# EAGLE design miniprinter-sanguinololu-longboard (EAGLE 9.4.2)
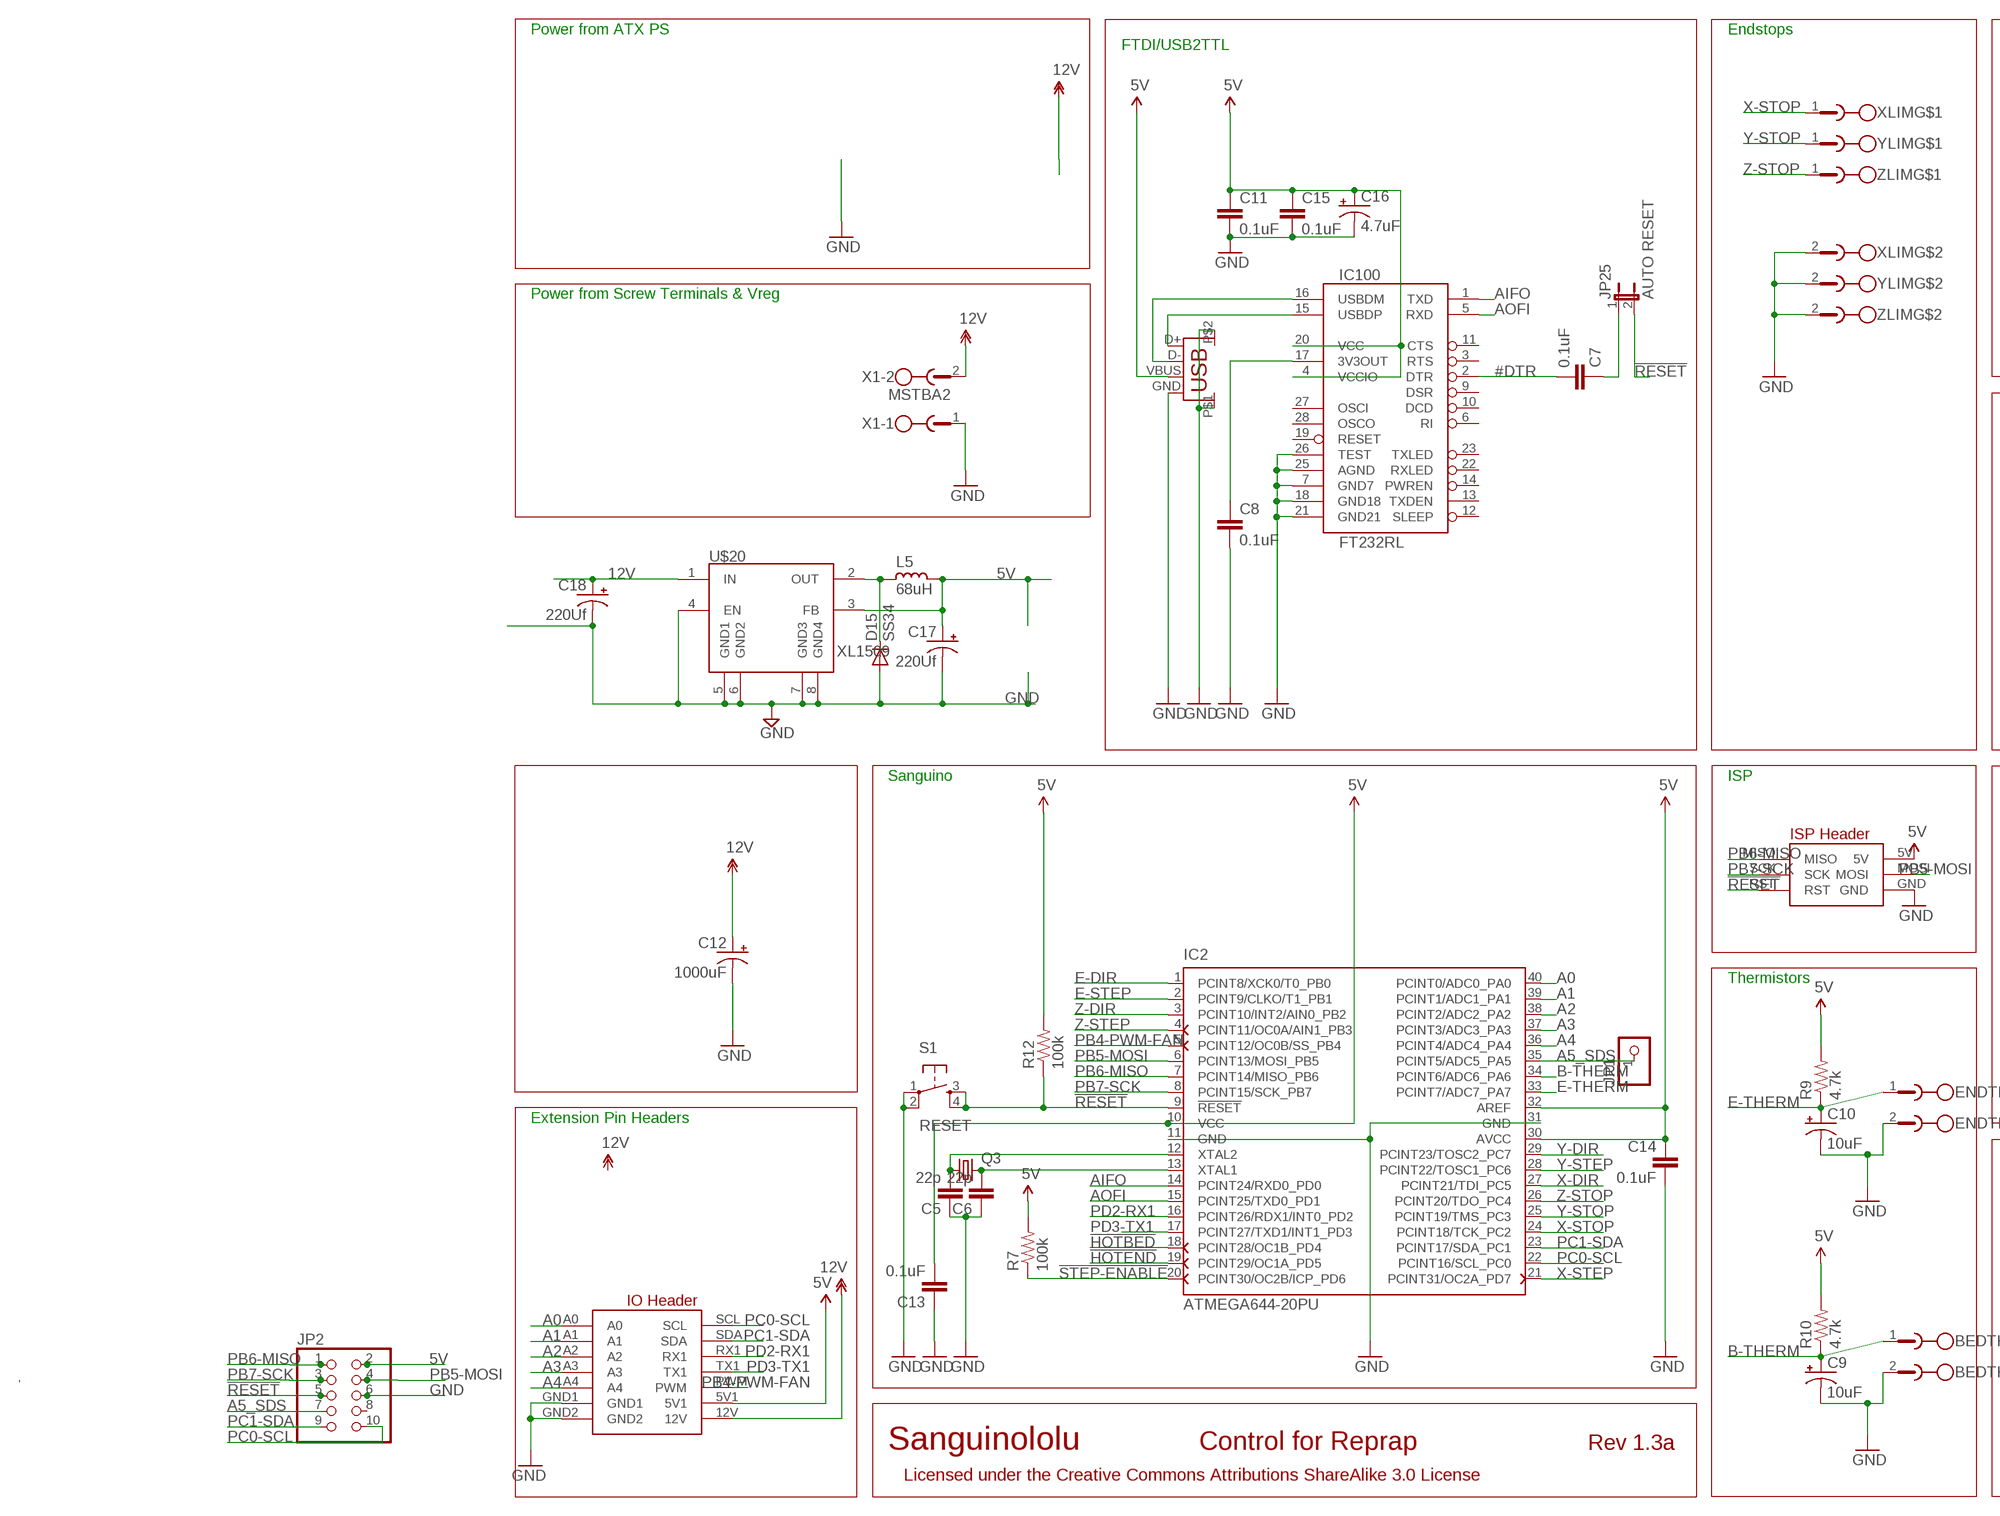
[diagram p0: schematic, sheet 1, part 1 of 2]
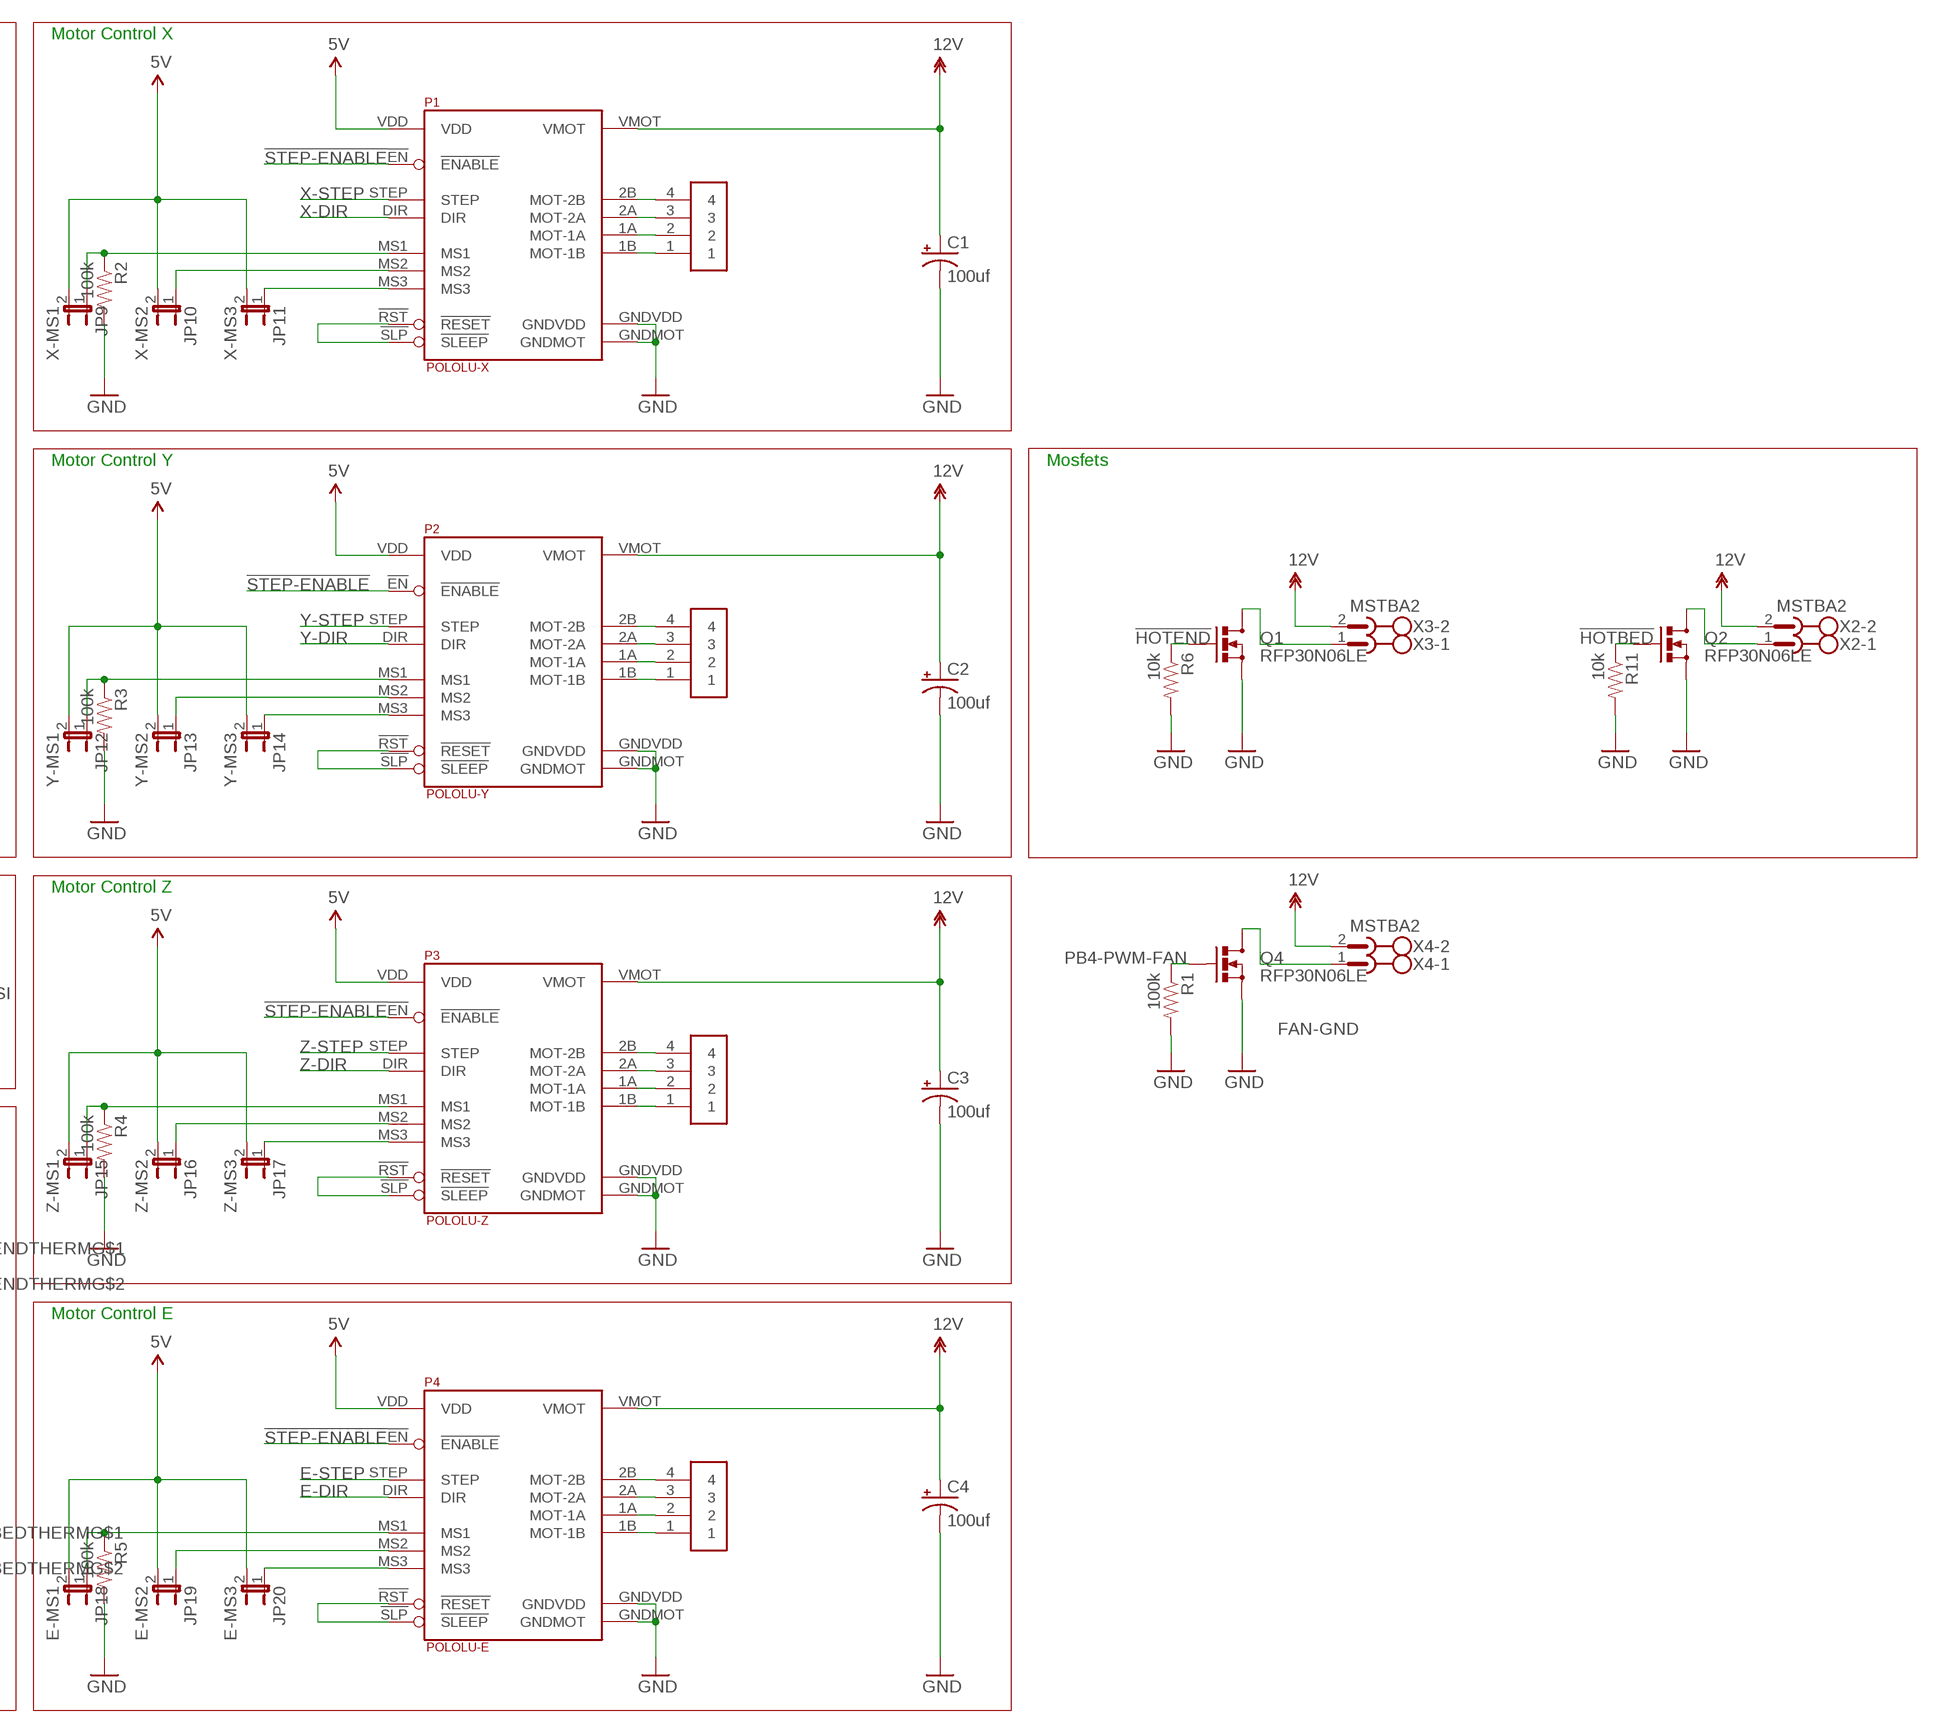
[diagram p1: schematic, sheet 1, part 2 of 2]

## Parts
BEDTHERM  Phoenix Pluggable 3.81mm 2 way  MC1.5/2  [MC1.5/2-G-3.81]
C1  100uf  CAP_POLPTH1  [CPOL-RADIAL-100UF-25V]
C2  100uf  CAP_POLPTH1  [CPOL-RADIAL-100UF-25V]
C3  100uf  CAP_POLPTH1  [CPOL-RADIAL-100UF-25V]
C4  100uf  CAP_POLPTH1  [CPOL-RADIAL-100UF-25V]
C5  22p  CAPPTH2  [CAP-PTH-SMALL2]
C6  22p  CAPPTH2  [CAP-PTH-SMALL2]
C7  0.1uF  CAPPTH2  [CAP-PTH-SMALL2]
C8  0.1uF  CAPPTH2  [CAP-PTH-SMALL2]
C9  10uF  CAP_POLPTH2  [CPOL-RADIAL-10UF-25V]
C10  10uF  CAP_POLPTH2  [CPOL-RADIAL-10UF-25V]
C11  0.1uF  CAPPTH2  [CAP-PTH-SMALL2]
C12  1000uF  CAP_POLPTH4  [CPOL-RADIAL-1000UF-25V]
C13  0.1uF  CAPPTH2  [CAP-PTH-SMALL2]
C14  0.1uF  CAPPTH2  [CAP-PTH-SMALL2]
C15  0.1uF  CAPPTH2  [CAP-PTH-SMALL2]
C16  4.7uF  CAP_POLPTH2  [CPOL-RADIAL-10UF-25V]
C17  220Uf  CAP_POLPTH1  [CPOL-RADIAL-100UF-25V]
C18  220Uf  CAP_POLPTH1  [CPOL-RADIAL-100UF-25V]
D15  SS34  DIODE-DO-214AC  [DO-214AC]
ENDTHERM  Phoenix Pluggable 3.81mm 2 way  MC1.5/2  [MC1.5/2-G-3.81]
IC2  ATMEGA644-20PU  [DIL40]
IC100  FT232RL  FT232RLSSOP  [SSOP28DB]
J1  USB  USBPTH  [USB-B-PTH]
JP1  PINHD-1X1  [1X01]
JP2  PINHD-2X5  [2X05]
JP9  X-MS1  JUMPER-2PTH  [1X02]
JP10  X-MS2  JUMPER-2PTH  [1X02]
JP11  X-MS3  JUMPER-2PTH  [1X02]
JP12  Y-MS1  JUMPER-2PTH  [1X02]
JP13  Y-MS2  JUMPER-2PTH  [1X02]
JP14  Y-MS3  JUMPER-2PTH  [1X02]
JP15  Z-MS1  JUMPER-2PTH  [1X02]
JP16  Z-MS2  JUMPER-2PTH  [1X02]
JP17  Z-MS3  JUMPER-2PTH  [1X02]
JP18  E-MS1  JUMPER-2PTH  [1X02]
JP19  E-MS2  JUMPER-2PTH  [1X02]
JP20  E-MS3  JUMPER-2PTH  [1X02]
JP25  AUTO RESET  JUMPER-2PTH  [1X02]
L5  68uH  L_CD75  [CD75]
P1  POLOLU-X  POLOLU-ALLEGRO  [POLOLU-ALLEGRO-PTH]
P2  POLOLU-Y  POLOLU-ALLEGRO  [POLOLU-ALLEGRO-PTH]
P3  POLOLU-Z  POLOLU-ALLEGRO  [POLOLU-ALLEGRO-PTH]
P4  POLOLU-E  POLOLU-ALLEGRO  [POLOLU-ALLEGRO-PTH]
Q1  RFP30N06LE  MOSFET-NCHANNELPTH2  [TO220V]
Q2  RFP30N06LE  MOSFET-NCHANNELPTH2  [TO220V]
Q3  CRYSTALHC49S  [HC49/S]
Q4  RFP30N06LE  MOSFET-NCHANNELPTH2  [TO220V]
R1  100k  RESISTORPTH1  [AXIAL-0.3]
R2  100k  RESISTORPTH1  [AXIAL-0.3]
R3  100k  RESISTORPTH1  [AXIAL-0.3]
R4  100k  RESISTORPTH1  [AXIAL-0.3]
R5  100k  RESISTORPTH1  [AXIAL-0.3]
R6  10k  RESISTORPTH1  [AXIAL-0.3]
R7  100k  RESISTORPTH1  [AXIAL-0.3]
R9  4.7k  RESISTORPTH1  [AXIAL-0.3]
R10  4.7k  RESISTORPTH1  [AXIAL-0.3]
R11  10k  RESISTORPTH1  [AXIAL-0.3]
R12  100k  RESISTORPTH1  [AXIAL-0.3]
S1  RESET  TAC_SWITCHPTH  [TACTILE-PTH]
U$17  CONNECTOR-M4  [3.81MM-4WAY-PLUGGABLE-SCREW]
U$20  XL1509  [SO08]
U$24  IO_HEADERS_SCREW  [IO_HEADER-PLATEDSCREW]
U$25  CONNECTOR-M4  [3.81MM-4WAY-PLUGGABLE-SCREW]
U$26  CONNECTOR-M4  [3.81MM-4WAY-PLUGGABLE-SCREW]
U$27  CONNECTOR-M4  [3.81MM-4WAY-PLUGGABLE-SCREW]
X1  MSTBA2  [MSTBA2]
X2  MSTBA2  [MSTBA2]
X3  MSTBA2  [MSTBA2]
X4  MSTBA2  [MSTBA2]
XLIM  Phoenix Pluggable 3.81mm 2 way  MC1.5/2  [MC1.5/2-G-3.81]
YLIM  Phoenix Pluggable 3.81mm 2 way  MC1.5/2  [MC1.5/2-G-3.81]
ZLIM  Phoenix Pluggable 3.81mm 2 way  MC1.5/2  [MC1.5/2-G-3.81]

## Nets
3V3: C8.1 IC100.17(3V3OUT)
5V: C11.1 C13.2 C14.1 C15.1 C16.1(+) C17.1(+) IC2.10(VCC) IC2.30(AVCC) IC2.32(AREF) IC100.4(VCCIO) IC100.20(VCC) J1.VBUS JP2.2 JP9.2 JP10.2 JP11.2 JP12.2 JP13.2 JP14.2 JP15.2 JP16.2 JP17.2 JP18.2 JP19.2 JP20.2 L5.1 P1.VDD P2.VDD P3.VDD P4.VDD R7.P$2 R9.P$2 R10.P$2 R12.P$2 U$20.3(FB) U$24.5V U$24.5V1
12V: C1.1(+) C2.1(+) C3.1(+) C4.1(+) C12.1(+) C18.1(+) P1.VMOT P2.VMOT P3.VMOT P4.VMOT U$20.1(IN) U$24.12V X1.2 X2.2 X3.2 X4.2
!FTDI-RESET: C7.1 JP25.1
!HOTBED: IC2.18(PCINT28/OC1B_PD4) Q2.1(G) R11.P$1
!HOTEND: IC2.19(PCINT29/OC1A_PD5) Q1.1(G) R6.P$1
!RESET: IC2.9(!RESET) JP2.5 JP25.2 R12.P$1 S1.3 S1.4 U$24.RST
!STEP-ENABLE: IC2.20(PCINT30/OC2B/ICP_PD6) P1.!EN(!ENABLE) P2.!EN(!ENABLE) P3.!EN(!ENABLE) P4.!EN(!ENABLE) R7.P$1
#DTR: C7.2 IC100.2(DTR)
A0: IC2.40(PCINT0/ADC0_PA0) U$24.A0
A1: IC2.39(PCINT1/ADC1_PA1) U$24.A1
A2: IC2.38(PCINT2/ADC2_PA2) U$24.A2
A3: IC2.37(PCINT3/ADC3_PA3) U$24.A3
A4: IC2.36(PCINT4/ADC4_PA4) U$24.A4
A5_SDS: IC2.35(PCINT5/ADC5_PA5) JP1.1 JP2.7
AIFO: IC2.14(PCINT24/RXD0_PD0) IC100.1(TXD)
AOFI: IC2.15(PCINT25/TXD0_PD1) IC100.5(RXD)
B-THERM: BEDTHERM.1 C9.1(+) IC2.34(PCINT6/ADC6_PA6) R10.P$1
E-DIR: IC2.1(PCINT8/XCK0/T0_PB0) P4.DIR
E-MS1: JP18.1 P4.MS1 R5.P$1
E-MS2: JP19.1 P4.MS2
E-MS3: JP20.1 P4.MS3
E-RESETSLEEP: P4.!RST(!RESET) P4.!SLP(!SLEEP)
E-STEP: IC2.2(PCINT9/CLKO/T1_PB1) P4.STEP
E-THERM: C10.1(+) ENDTHERM.1 IC2.33(PCINT7/ADC7_PA7) R9.P$1
FAN-GND [power]: Q4.2(D) X4.1
GND [power]: BEDTHERM.2 C1.2(-) C2.2(-) C3.2(-) C4.2(-) C5.1 C6.1 C8.2 C9.2(-) C10.2(-) C11.2 C12.2(-) C13.1 C14.2 C15.2 C16.2(-) C17.2(-) C18.2(-) D15.2(A) ENDTHERM.2 IC2.11(GND) IC2.31(GND) IC100.7(GND7) IC100.18(GND18) IC100.21(GND21) IC100.25(AGND) IC100.26(TEST) J1.GND J1.P$1 J1.P$2 JP2.6 P1.GNDMOT P1.GNDVDD P2.GNDMOT P2.GNDVDD P3.GNDMOT P3.GNDVDD P4.GNDMOT P4.GNDVDD Q1.3(S) Q2.3(S) Q4.3(S) R1.P$2 R2.P$2 R3.P$2 R4.P$2 R5.P$2 R6.P$2 R11.P$2 S1.1 S1.2 U$20.4(EN) U$20.5(GND1) U$20.6(GND2) U$20.7(GND3) U$20.8(GND4) U$24.GND U$24.GND1 U$24.GND2 X1.1 XLIM.2 YLIM.2 ZLIM.2
HOTBED-GND [power]: Q2.2(D) X2.1
HOTEND-GND [power]: Q1.2(D) X3.1
N$1: P4.1B(MOT-1B) U$27.1
N$3: P4.1A(MOT-1A) U$27.2
N$4: P4.2A(MOT-2A) U$27.3
N$5: P4.2B(MOT-2B) U$27.4
N$6: P3.1B(MOT-1B) U$26.1
N$7: P3.1A(MOT-1A) U$26.2
N$8: P3.2A(MOT-2A) U$26.3
N$9: P3.2B(MOT-2B) U$26.4
N$10: P2.1B(MOT-1B) U$25.1
N$11: P2.1A(MOT-1A) U$25.2
N$12: P2.2A(MOT-2A) U$25.3
N$13: P2.2B(MOT-2B) U$25.4
N$14: P1.1B(MOT-1B) U$17.1
N$15: P1.1A(MOT-1A) U$17.2
N$16: P1.2A(MOT-2A) U$17.3
N$17: P1.2B(MOT-2B) U$17.4
N$23: D15.1(C) L5.2 U$20.2(OUT)
PB4-PWM-FAN: IC2.5(PCINT12/OC0B/SS_PB4) Q4.1(G) R1.P$1 U$24.PWM
PB5-MOSI: IC2.6(PCINT13/MOSI_PB5) JP2.4 U$24.MOSI
PB6-MISO: IC2.7(PCINT14/MISO_PB6) JP2.1 U$24.MISO
PB7-SCK: IC2.8(PCINT15/SCK_PB7) JP2.3 U$24.SCK
PC0-SCL: IC2.22(PCINT16/SCL_PC0) JP2.10 U$24.SCL
PC1-SDA: IC2.23(PCINT17/SDA_PC1) JP2.9 U$24.SDA
PD2-RX1: IC2.16(PCINT26/RDX1/INT0_PD2) U$24.RX1
PD3-TX1: IC2.17(PCINT27/TXD1/INT1_PD3) U$24.TX1
USBDM: IC100.16(USBDM) J1.D-
USBDP: IC100.15(USBDP) J1.D+
X-DIR: IC2.27(PCINT21/TDI_PC5) P1.DIR
X-MS1: JP9.1 P1.MS1 R2.P$1
X-MS2: JP10.1 P1.MS2
X-MS3: JP11.1 P1.MS3
X-RESETSLEEP: P1.!RST(!RESET) P1.!SLP(!SLEEP)
X-STEP: IC2.21(PCINT31/OC2A_PD7) P1.STEP
X-STOP: IC2.24(PCINT18/TCK_PC2) XLIM.1
XTAL1: C6.2 IC2.13(XTAL1) Q3.2
XTAL2: C5.2 IC2.12(XTAL2) Q3.1
Y-DIR: IC2.29(PCINT23/TOSC2_PC7) P2.DIR
Y-MS1: JP12.1 P2.MS1 R3.P$1
Y-MS2: JP13.1 P2.MS2
Y-MS3: JP14.1 P2.MS3
Y-RESETSLEEP: P2.!RST(!RESET) P2.!SLP(!SLEEP)
Y-STEP: IC2.28(PCINT22/TOSC1_PC6) P2.STEP
Y-STOP: IC2.25(PCINT19/TMS_PC3) YLIM.1
Z-DIR: IC2.3(PCINT10/INT2/AIN0_PB2) P3.DIR
Z-MS1: JP15.1 P3.MS1 R4.P$1
Z-MS2: JP16.1 P3.MS2
Z-MS3: JP17.1 P3.MS3
Z-RESETSLEEP: P3.!RST(!RESET) P3.!SLP(!SLEEP)
Z-STEP: IC2.4(PCINT11/OC0A/AIN1_PB3) P3.STEP
Z-STOP: IC2.26(PCINT20/TDO_PC4) ZLIM.1
Unconnected: IC100.3(RTS) IC100.6(RI) IC100.9(DSR) IC100.10(DCD) IC100.11(CTS) IC100.12(SLEEP) IC100.13(TXDEN) IC100.14(PWREN) IC100.19(RESET) IC100.22(RXLED) IC100.23(TXLED) IC100.27(OSCI) IC100.28(OSCO) JP2.8 U$24.GNDSCREW(GND-SCREW)

## Notes on the sheet
- Power from ATX PS | Endstops | Motor Control X
- FTDI/USB2TTL
- Power from Screw Terminals & Vreg
- Motor Control Y | Mosfets
- Sanguino | ISP | Motor Control Z
- Thermistors
- Extension Pin Headers
- Motor Control E
- Sanguinololu | Control for Reprap | Rev 1.3a
- Licensed under the Creative Commons Attributions ShareAlike 3.0 License

## Library data of the parts
BEDTHERM ENDTHERM XLIM YLIM ZLIM = jt-con-phoenix-3.81:MC1.5/2
C1-C4 C9 C10 C12 C16-C18 = SparkFun:CAP_POL: Capacitor Polarized These are standard SMD and PTH capacitors. Normally 10uF, 47uF, and 100uF in electrolytic and tantalum varieties. Always verify the external diameter of the through hole cap, it varies with capacity, voltage, and manufacturer. The EIA devices should be standard.
C5-C8 C11 C13-C15 = SparkFun:CAP: Capacitor Standard 0603 ceramic capacitor, and 0.1" leaded capacitor.
D15 = dp_devices:DIODE: Various Diode Packages
IC2 = atmel:ATMEGA644-*PU: 8-bit Microcontroller with 64K Bytes In-System Programmable Flash Auto generated by make-symbol-device-package-bsdl.ulp Rev. 34 Source: http://www.atmel.com/dyn/resources/prod_documents/doc2593.pdf; MPN: ATMEGA644-20PU; OC_FARNELL: 1288340; OC_NEWARK: 23M5060
IC100 = SparkFun:FT232RL: USB UART FT232RL 4th Generation USB UART (USB <-> Serial) Controller. Spark Fun Electronics SKU : COM-00650
J1 = SparkFun:USB: USB Connectors USB-B-PTH is fully proven SKU : PRT-00139 USB-miniB is fully proven SKU : PRT-00587 USB-A-PCB is untested. USB-A-H is throughly reviewed, but untested. Spark Fun Electronics SKU : PRT-00437 USB-B-SMT is throughly reviewed, but untested. Needs silkscreen touching up. USB-A-S has not been used/tested USB-MB-H has not been used/tested
JP1 = pinhead:PINHD-1X1: PIN HEADER
JP2 = pinhead:PINHD-2X5: PIN HEADER
JP9-JP20 JP25 = SparkFun:JUMPER-2: Jumper Basic 0.1" spaced jumper. Use with breakaway headers.
L5 = rc-master-smd:L_: INDUCTOR
P1-P4 = pololu-allegro:POLOLU-ALLEGRO
Q1 Q2 Q4 = SparkFun:MOSFET-NCHANNEL
Q3 = crystal:CRYSTAL: CRYSTAL; OC_FARNELL: 1667008; OC_NEWARK: unknown
R1-R7 R9-R12 = SparkFun:RESISTOR: Resistor Basic schematic elements and footprints for 0603, 1206, and PTH 1/10th watt (small) resistors.
S1 = SparkFun:TAC_SWITCH: Momentary Switch Button commonly used for reset or general input. Spark Fun Electronics SKU : COM-00097
U$17 U$25-U$27 = openbuilds-eagle-library:CONNECTOR-M4
U$20 = Cohesion_parts:XL1509
U$24 = Sanguinololu:IO_HEADERS_SCREW
X1-X4 = con-phoenix-508:MSTBA2: PHOENIX; MF: FARNELL; MPN: 1757242; OC_FARNELL: 3705171; OC_NEWARK: 71C4161

## Board
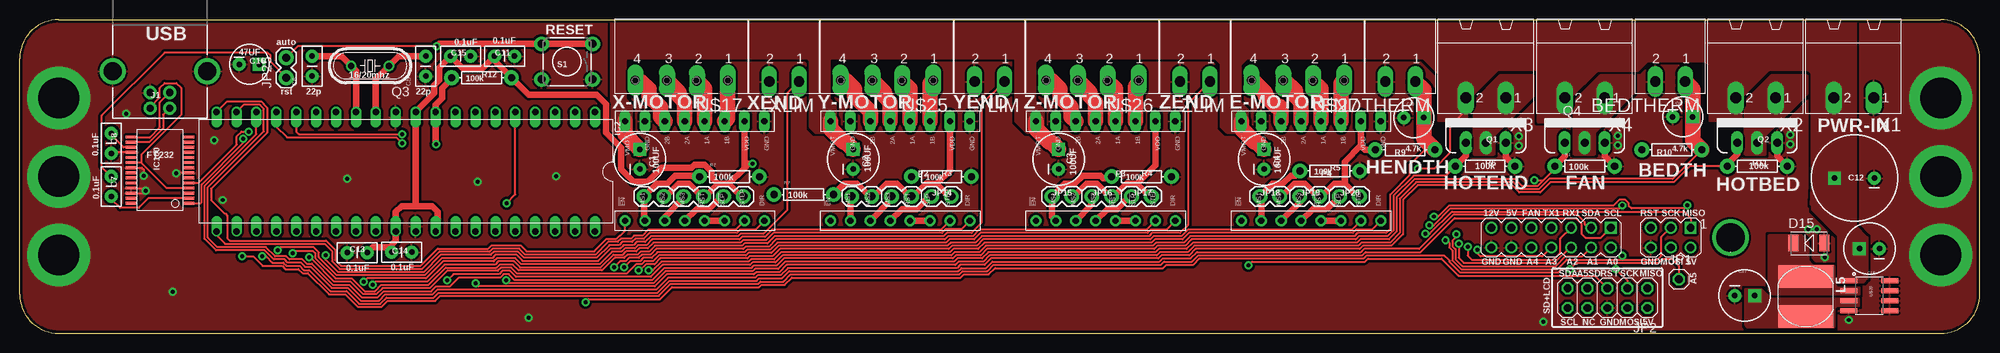
[diagram p2: board, top side]
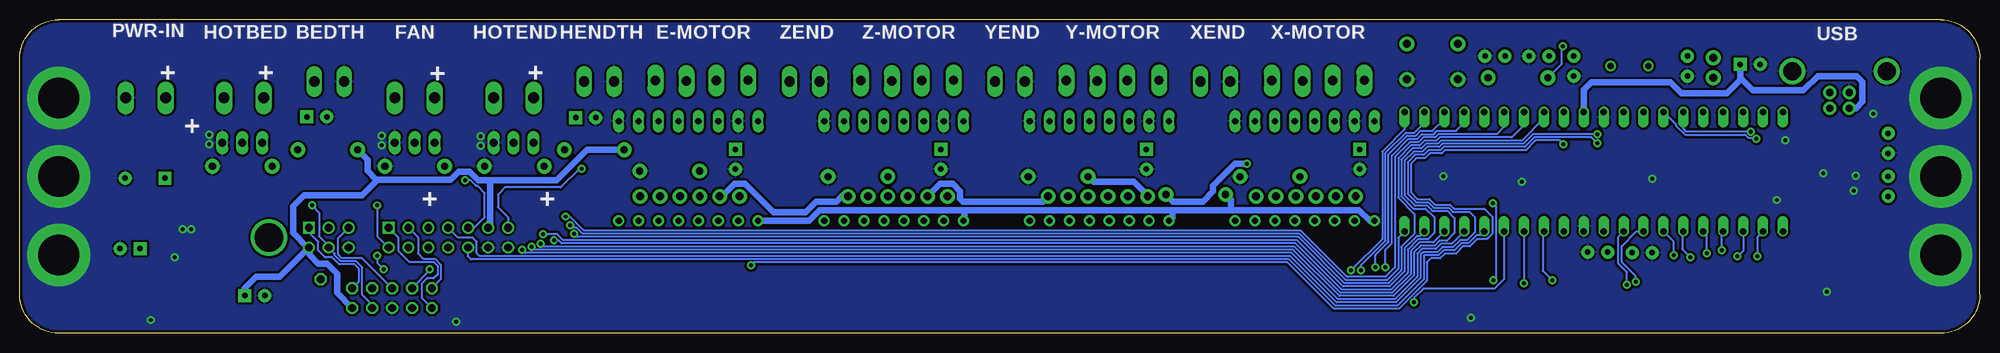
[diagram p3: board, bottom side, seen from below]

Size 250 x 40 mm. Coordinates in mm from the lower left corner, seen from the top.
Outline: 5,40 245,40 arc-90 250,35 250,5 arc-90 245,0 5,0 arc-90 0,5 0,35 arc-90 5,40
Copper layers (1*16): Top 0.035mm / dielectric 1.5mm / Bottom 0.035mm
Design rules "10width10space20drill10annular *": minimum track width 10mil, minimum drill 20mil, track to track 6mil, track to pad 6mil, pad to pad 6mil, via to via 6mil, smd to smd 0mil, copper to edge 10mil, drill to drill 10mil, minimum pad ring 10mil, minimum via ring 10mil, stop-mask expansion 2mil, vias tented up to drill 25mil, thermal gap 10mil

### Footprints (pad centres in the part's own frame; a part is rotated, then mirrored left to right if it is on the bottom)
MC1.5/2-G-3.81 = drill 1.3 long: 1 -3.81,8; 2 0,8
CPOL-RADIAL-100UF-25V = drill 0.7 pad 1.651 square: 1 1.27,0 | drill 0.7 pad 1.651: 2 -1.27,0
CAP-PTH-SMALL2 = drill 0.7 pad 1.651: 1 0,0; 2 2.54,0
CPOL-RADIAL-10UF-25V = drill 0.7 pad 1.651 square: 1 1.27,0 | drill 0.7 pad 1.651: 2 -1.27,0
CPOL-RADIAL-1000UF-25V = drill 0.7 pad 1.651 square: 1 2.54,0 | drill 0.7 pad 1.651: 2 -2.54,0
DO-214AC = smd 1.27 x 2.1: 1 -1.98,0; 2 1.98,0
DIL40 = drill 0.813 offset: 1 -24.13,-7.62; 2 -21.59,-7.62; 3 -19.05,-7.62; 4 -16.51,-7.62; 5 -13.97,-7.62; 6 -11.43,-7.62; 7 -8.89,-7.62; 8 -6.35,-7.62; 9 -3.81,-7.62; 10 -1.27,-7.62; 11 1.27,-7.62; 12 3.81,-7.62; 13 6.35,-7.62; 14 8.89,-7.62; 15 11.43,-7.62; 16 13.97,-7.62; 17 16.51,-7.62; 18 19.05,-7.62; 19 21.59,-7.62; 20 24.13,-7.62; 21 24.13,7.62; 22 21.59,7.62; 23 19.05,7.62; 24 16.51,7.62; 25 13.97,7.62; 26 11.43,7.62; 27 8.89,7.62; 28 6.35,7.62; 29 3.81,7.62; 30 1.27,7.62; 31 -1.27,7.62; 32 -3.81,7.62; 33 -6.35,7.62; 34 -8.89,7.62; 35 -11.43,7.62; 36 -13.97,7.62; 37 -16.51,7.62; 38 -19.05,7.62; 39 -21.59,7.62; 40 -24.13,7.62
SSOP28DB = smd 0.348 x 1.397: 1 -4.225,-3.656; 2 -3.575,-3.656; 3 -2.925,-3.656; 4 -2.275,-3.656; 5 -1.625,-3.656; 6 -0.975,-3.656; 7 -0.325,-3.656; 8 0.325,-3.656; 9 0.975,-3.656; 10 1.625,-3.656; 11 2.275,-3.656; 12 2.925,-3.656; 13 3.575,-3.656; 14 4.225,-3.656; 15 4.225,3.656; 16 3.575,3.656; 17 2.925,3.656; 18 2.275,3.656; 19 1.625,3.656; 20 0.975,3.656; 21 0.325,3.656; 22 -0.325,3.656; 23 -0.975,3.656; 24 -1.625,3.656; 25 -2.275,3.656; 26 -2.925,3.656; 27 -3.575,3.656; 28 -4.225,3.656
USB-B-PTH = drill 0.914 pad 1.676: D+ 0,1.25; D- 1.981,1.25; GND 0,-1.25; VBUS 1.981,-1.25 | drill 2.286: P$1 -2.718,-6.02; P$2 -2.718,6.02
1X01 = drill 1.016 octagon: 1 0,0
2X05 = drill 1.016 octagon: 1 -5.08,-1.27; 2 -5.08,1.27; 3 -2.54,-1.27; 4 -2.54,1.27; 5 0,-1.27; 6 0,1.27; 7 2.54,-1.27; 8 2.54,1.27; 9 5.08,-1.27; 10 5.08,1.27
1X02 = drill 1.016 pad 1.88: 1 0,0; 2 2.54,0
CD75 = smd 7 x 2.85: 1 0,2.54; 2 0,-2.54
POLOLU-ALLEGRO-PTH = drill 0.8 pad 1.422 long: 1A 6.35,-1.27; 1B 6.35,-3.81; 2A 6.35,1.27; 2B 6.35,3.81; GNDMOT 6.35,6.35; GNDVDD 6.35,-8.89; VDD 6.35,-6.35; VMOT 6.35,8.89 | drill 0.8 pad 1.422: !EN -6.35,8.89; !RST -6.35,-1.27; !SLP -6.35,-3.81; DIR -6.35,-8.89; MS1 -6.35,6.35; MS2 -6.35,3.81; MS3 -6.35,1.27; STEP -6.35,-6.35
TO220V = drill 1.016 long: 1 -2.54,0; 2 0,0; 3 2.54,0
HC49/S = drill 0.813: 1 -2.413,0; 2 2.413,0
AXIAL-0.3 = drill 0.9 pad 1.88: P$1 -3.81,0; P$2 3.81,0
TACTILE-PTH = drill 1.016 pad 1.88: 1 -3.251,2.261; 2 3.251,2.261; 3 -3.251,-2.261; 4 3.251,-2.261
3.81MM-4WAY-PLUGGABLE-SCREW = drill 1.2 pad 2.032 long: 1 5.905,-7.874; 2 1.968,-7.945; 3 -1.841,-7.889; 4 -5.905,-7.833
SO08 = smd 0.61 x 2.21: 1 -1.905,-2.616; 2 -0.635,-2.616; 3 0.635,-2.616; 4 1.905,-2.616; 5 1.905,2.616; 6 0.635,2.616; 7 -0.635,2.616; 8 -1.905,2.616
IO_HEADER-PLATEDSCREW = drill 1: 5V -5.08,-1.27; 5V1 -27.94,1.27; 12V -30.48,1.27; A0 -15.24,-1.27; A1 -17.78,-1.27; A2 -20.32,-1.27; A3 -22.86,-1.27; A4 -25.4,-1.27; GND -10.16,-1.27; GND1 -27.94,-1.27; GND2 -30.48,-1.27; MOSI -7.62,-1.27; PWM -25.4,1.27; RST -10.16,1.27; RX1 -20.32,1.27; SCK -7.62,1.27; SDA -17.78,1.27; TX1 -22.86,1.27 | drill 3.6: GNDSCREW 0,0 | drill 1 square: MISO -5.08,1.27; SCL -15.24,1.27
MSTBA2 = drill 1.397 long: 1 -2.54,5.08; 2 2.54,5.08

### Placement (x,y rotation side)
BEDTHERM  208.6,40.1 180 top
C1  79.1,22.2 90 top
C2  106.3,22.2 90 top
C3  132.5,22.2 90 top
C4  158.7,22.2 90 top
C5  51.8,32.8 90 top
C6  37.3,32.8 90 top
C7  11.7,20 270 top
C8  11.7,25.5 270 top
C9  212.1,27.6 0 top
C10  177.8,27.5 0 top
C11  60.57,35.34 0 top
C12  234,19.8 180 top
C13  41.8,10.3 0 top
C14  47.46,10.34 0 top
C15  54.97,35.34 0 top
C16  29.3,34.3 0 top
C17  220,4.8 0 top
C18  235.9,10.8 180 top
D15  228.2,11.5 0 top
ENDTHERM  174.2,40.1 180 top
IC2  49.25,20.61 180 top
IC100  17.9,20.8 90 top
J1  17.9,30.7 270 top
JP1  211.6,6.9 0 top
JP2  202.5,4.5 180 top
JP9  79.61,17.45 0 top
JP10  84.69,17.45 0 top
JP11  89.77,17.45 0 top
JP12  106.13,17.45 0 top
JP13  111.21,17.45 0 top
JP14  116.29,17.45 0 top
JP15  131.65,17.45 0 top
JP16  136.73,17.45 0 top
JP17  141.81,17.45 0 top
JP18  158.17,17.45 0 top
JP19  163.25,17.45 0 top
JP20  168.33,17.45 0 top
JP25  34,32.6 90 top
L5  227.8,4.7 180 top
P1  86.1,20.7 90 top
P2  112.3,20.7 90 top
P3  138.5,20.7 90 top
P4  164.7,20.7 90 top
Q1  187,24.3 0 top
Q2  221.6,24.3 0 top
Q3  44.7,34.1 180 top
Q4  199.6,24.3 0 top
R1  199.6,21.3 0 top
R2  90.54,19.99 0 top
R3  117.56,19.99 0 top
R4  143.08,19.99 0 top
R5  167.1,20.7 0 top
R6  186.9,21.3 0 top
R7  100,17.7 0 top
R9  176.7,23.4 180 top
R10  210.7,23.4 180 top
R11  221.6,21.3 0 top
R12  58.91,32.59 0 top
S1  69.82,34.64 180 top
U$17  84.4,40.1 0 top
U$20  235.9,4.8 270 top
U$24  218.19,12.21 0 top
U$25  110.6,40.1 0 top
U$26  136.8,40.1 0 top
U$27  163,40.1 0 top
X1  233.9,35.1 180 top
X2  221.4,35.1 180 top
X3  187,35.1 180 top
X4  199.6,35.1 180 top
XLIM  95.6,40.1 180 top
YLIM  121.8,40.1 180 top
ZLIM  148,40.1 180 top

### Tracks (layer width: path | path; a pad name or v marks a point on that pad's centre or on a via)
3V3
  Top 0.254: IC100.17 13.28,23.73 11.7,25.3 C8.1
5V  (via drill 0.51)
  Top 0.254: IC100.4 18.77,18.52 15.53,21.77 | 15.53,21.77 IC100.20 | J1.VBUS 16.65,28.85 17.9,30.1 17.9,31.3 18.5,31.9 20,31.9 20.6,31.3 20.6,27.85 15.53,22.78 15.53,21.77
  Top 0.813: JP9.2 82.43,17.45 84.03,19.05 85.35,19.05 86.95,17.45 JP10.2 87.51,17.45 89.11,19.05 | 89.11,19.05 90.43,19.05 | JP11.2 92.03,17.45 90.43,19.05 | 116.95,19.05 115.63,19.05 114.03,17.45 JP13.2 113.47,17.45 111.87,19.05 110.55,19.05 108.95,17.45 JP12.2 108.39,17.45 106.79,19.05 105.16,19.05 R7.P$2 | JP14.2 118.55,17.45 116.95,19.05 | JP15.2 134.47,17.45 136.07,19.05 137.39,19.05 138.99,17.45 JP16.2 139.55,17.45 141.15,19.05 142.47,19.05 | JP17.2 144.07,17.45 142.47,19.05 | JP18.2 160.99,17.45 162.59,19.05 163.91,19.05 165.51,17.45 JP19.2 166.07,17.45 167.67,19.05 168.99,19.05 | JP20.2 170.59,17.45 168.99,19.05 | 90.43,19.05 92.45,21.07 | 92.45,21.07 P1.VDD | P2.VDD 118.65,20.75 116.95,19.05 | P3.VDD 144.85,21.43 142.47,19.05 | 92.45,21.07 92.98,21.6 v93.5,21.6 | 168.99,19.05 168.99,21.89 171.05,23.95 | 171.05,23.95 P4.VDD | R9.P$2 171.6,23.4 171.05,23.95 | 47.2,11 47.98,11.78 IC2.30 47.98,15.48 48.7,16.2 50.4,16.2 | 47.2,11 47.2,10.6 C14.1 | C13.2 45.04,11 47.2,11 | IC2.32 53.3,13.23 53.3,15.5 52.6,16.2 50.4,16.2 | 89.11,19.05 88.23,19.93 88.23,20.61 87.35,21.49 86.11,21.49 85.7,21.08 81.88,21.08 80.09,19.3 78.3,19.3 76.7,20.9 76.7,23.67 74.8,25.57 74.8,29.2 73.61,30.39 64.92,30.39 R12.P$2 60.57,34.74 C11.1 59.09,33.86 56.46,33.86 C15.1 53.5,33.87 53.5,32.26 52.9,31.65 52.9,30.61 IC2.10 50.52,16.32 50.4,16.2
  Bottom 0.254: 213,10.94 U$24.5V
  Bottom 0.813: JP14.2 119.49,16.79 129.69,16.79 130.05,17.15 130.05,18.11 130.99,19.05 132.59,19.05 JP15.2 | v93.5,21.6 95,21.6 97.79,18.81 97.79,18.1 99.1,16.79 102.9,16.79 R7.P$2 | JP17.2 145.15,17.45 145.81,16.79 148.4,16.79 149.77,15.42 153.87,15.42 157.51,19.05 158.83,19.05 160.43,17.45 JP18.2 | R9.P$2 177.6,23.4 181.5,19.5 190,19.5 | R10.P$2 205.6,22.11 205.6,20.7 204.5,19.6 | 190,19.5 191.5,19.5 192.6,20.6 194,20.6 195,19.6 204.5,19.6 | IC2.10 50.52,31.03 49.55,32 39.46,32 38.07,30.62 32.27,30.62 30.57,32.31 C16.1 30.57,32.6 28.97,31 22.5,31 20.7,32.8 15.7,32.8 15,32.1 15,29.5 15.78,28.72 J1.VBUS | U$24.5V1 190,13.73 190,19.5 | 204.5,19.6 204.5,19.4 206.3,17.6 213.7,17.6 215.1,16.2 215.1,12.8 213.24,10.94 U$24.5V 216.85,7.2 219.8,7.2 221.27,5.73 C17.1 | JP2.2 209.5,5.15 209.5,7.6 210.8,8.9 211.9,8.9 213,10 213,10.94
  pour Top (rank 2, no thermals): 220,5.6 220,1.1 220.3,0.8 231.4,0.8 231.5,0.9 231.5,3.2 231.7,3.4 231.8,3.5 234,3.5 234.6,3.5 234.6,4.4 223.4,4.4 222.9,4.9 222.2,5.6
12V  (via drill 0.51)
  Top 0.254: X3.2 184.46,28.46 182.4,26.4 182.4,23 180.4,21 v178.3,21
  Top 2: P1.VMOT 77.21,25.36 C1.1 | C2.1 105.4,24.37 105.14,24.37 103.41,26.1 P2.VMOT | C3.1 131.6,24.37 131.34,24.37 129.61,26.1 P3.VMOT | C4.1 157.8,24.37 157.54,24.37 155.81,26.1 P4.VMOT
  Bottom 0.254: v178.3,21 178.6,21 181,18.6 188.1,18.6 189,17.7 189,16.1 187.71,14.81 U$24.12V
  pour Top (rank 2, no thermals): 228.6,18.6 228.6,33.1 228.1,33.6 223.1,33.6 219.6,30.1 219.6,27.1 215.6,27.1 215.6,34.1 215.1,34.6 207.6,34.7 206.4,33.5 201.2,33.5 197.6,29.9 197.6,26.9 193.7,26.9 193.7,33.6 188.5,33.6 184.5,29.6 184.5,27.1 181,27.1 181,33.1 179,35.1 156.5,35.1 155.6,34.2 155.6,29.5 156.5,28.6 156.5,26.1 156,25.6 154,25.6 153.3,26.3 153.3,34.3 152.5,35.1 130,35.1 129.4,34.5 129.4,29.7 130.5,28.6 130.5,26.1 130,25.6 128.5,25.6 127.1,27 127.1,35 127,35.1 103.5,35.1 103.2,34.8 103.2,29.9 104,29.1 104,26.1 103.5,25.6 101.5,25.6 100.9,26.2 100.9,34.7 100.5,35.1 77.5,35.1 77.2,34.8 77.2,29.9 78,29.1 78,26.1 77.5,25.6 75.5,25.6 75.5,40.1 234.1,40.1 234.1,13.7 235.6,12.2 235.6,7 235.1,6.5 232.1,6.5 232,6.6 232,12.4 228.7,15.7 228.7,16.2 228.5,16.4
!FTDI-RESET
  Top 0.254: C7.1 10.5,21.2 10.5,27.8 18.5,35.8 31.6,35.8 32,35.4 32,34.6 JP25.1
!HOTBED
  Top 0.254: R11.P$1 212.99,21.3 210.98,19.29 195.24,19.29 193.94,17.99 191.26,17.99 190.36,18.89 189.93,18.89 189.7,18.89 178.3,18.89 176.43,17.02 176.43,12.63 174.97,11.17 171.32,11.17 170.91,10.76 149.99,10.76 149.17,9.95 145.62,9.95 145.22,9.54 123.89,9.54 123.08,8.74 119.93,8.74 119.52,8.32 97.98,8.32 97.06,7.41 94.13,7.41 93.83,7.1 82.7,7.1 81.17,5.57 53.28,5.57 52.66,4.95 46.61,4.95 45.83,4.17 43.47,4.17 41.86,5.79 39.79,5.79 37.1,8.48 36.42,8.48 35.88,9.01 34.21,9.01 33.81,9.42 32.41,9.42 31.24,10.59 25.04,10.59 23.6,12.03 23.6,18.8 30.2,25.4 IC2.18
  Top 0.813: Q2.1 219.06,22.86 217.79,21.59 R11.P$1
!HOTEND
  Top 0.254: IC2.19 28.6,29.17 30.59,29.17 30.66,29.1 30.7,29.1 30.7,29.06 31.14,28.62 31.14,25.77 24.01,18.63 24.01,12.2 25.21,11 26.02,11 26.03,10.99 31.41,10.99 32.57,9.82 33.98,9.82 34.38,9.42 36.05,9.42 36.59,8.89 37.26,8.89 39.95,6.19 42.02,6.19 43.64,4.58 45.66,4.58 46.44,5.36 52.49,5.36 53.11,5.98 54.88,5.98 56.05,7.15 61.32,7.15 61.72,7.55 62.38,7.55 63.14,6.79 80.67,6.79 82.2,8.32 93.32,8.32 93.62,8.63 96.56,8.63 97.47,9.54 119.02,9.54 119.43,9.95 122.58,9.95 123.39,10.76 144.71,10.76 145.12,11.17 148.67,11.17 149.48,11.98 170.41,11.98 170.81,12.39 174.46,12.39 175.21,13.13 175.21,17.52 177.79,20.11 181.9,20.11 R6.P$1
  Top 0.813: Q1.1 184.46,22.67 R6.P$1
!RESET  (via drill 0.51)
  Top 0.254: v53.2,36.6 35.46,36.6 JP25.2 | v156.7,8.66 157.18,9.14 171.58,9.14 171.97,9.53 181.35,9.53 183.51,7.36 200.91,7.36 JP2.5
  Top 0.813: R12.P$1 54.57,32.06 54.57,31.96 53.86,31.25 53.86,29.96 53.06,29.16 IC2.9 53.06,24.14 v53.1,24.1 | v53.2,36.6 53.5,36.9 65.37,36.9 S1.4 S1.3
  Bottom 0.254: R12.P$1 53.3,34.39 53.3,36.5 v53.2,36.6 | v53.1,24.1 53.59,24.59 56.66,24.59 57.89,23.36 68.22,23.36 68.62,22.95 70.15,22.95 70.75,22.35 71.87,22.35 72.56,21.65 72.56,17.96 71.72,17.12 70.19,17.12 69.49,16.41 67.56,16.41 67.06,15.91 63.21,15.91 62.16,14.86 62.16,12.7 62.76,12.1 62.78,12.1 62.88,12 64.15,12 65.06,11.09 65.94,11.09 66.85,10.17 68.24,10.17 68.86,9.55 70.05,9.55 70.53,9.07 70.53,6.72 74.12,3.14 82.39,3.14 88.28,9.04 156.32,9.04 v156.7,8.66 | U$24.RST 209.4,12.11 209.4,10.1 208.9,9.6 206.33,9.6 JP2.5
!STEP-ENABLE
  Top 0.254: P1.!EN 77.2,13.07 76.6,12.47 76.52,12.47 76.11,12.06 74.88,12.06 73.28,10.45 64.65,10.45 63.89,11.21 60.17,11.21 59.76,10.81 53.34,10.81 51.16,8.63 40.97,8.63 40.24,9.36 40.24,10.64 39.07,11.81 26.79,11.81 26.5,12.1 26.5,15 26.2,15.3 26.11,15.3 24.41,17 24.41,18.46 31.55,25.6 31.55,28.79 31.11,29.23 31.11,29.27 30.8,29.58 26.47,29.58 IC2.20
  Bottom 0.813: P1.!EN 77.81,14.35 79.18,15.72 95.5,15.72 | P4.!EN 149.33,14.35 147.96,15.72 129.5,15.72 | 95.5,15.72 103,15.72 | 103,15.72 129.5,15.72 | P3.!EN 129.5,14.46 129.5,15.72 | P2.!EN 103,14.76 103,15.72 | 95.5,15.72 95.5,17.01 R7.P$1
#DTR
  Top 0.254: IC100.2 16.43,17.23 15.2,16 12.8,16 11.7,17.1 C7.2
A0  (via drill 0.51)
  Top 0.254: v179.82,13.78 180.36,13.78 182.5,15.92 204.02,15.92 v204.4,16.3
  Bottom 0.254: IC2.40 74.19,12.18 74.19,8.24 75.63,6.79 80.87,6.79 86.77,12.69 178.19,12.69 178.95,13.46 179.49,13.46 v179.82,13.78 | v204.4,16.3 204.4,12.39 U$24.A0
A1  (via drill 0.51)
  Top 0.254: v183.25,12.62 183.25,12.29 182.74,11.77 182.74,11.12 183.12,10.74 183.12,9.48 184.02,8.58 195.93,8.58 197.15,9.8 199.27,9.8 U$24.A1
  Bottom 0.254: IC2.39 71.43,12.4 71.83,12.4 73.38,10.85 73.38,7.9 75.3,5.98 81.2,5.98 87.11,11.88 180.68,11.88 181.44,12.64 182.69,12.64 182.72,12.62 v183.25,12.62
A2  (via drill 0.51)
  Top 0.254: v183.53,11.45 183.53,9.64 184.19,8.99 195.76,8.99 197.72,10.94 U$24.A2
  Bottom 0.254: IC2.38 69.7,11.59 71.49,11.59 72.56,10.51 72.56,7.56 74.96,5.17 81.54,5.17 87.44,11.07 183.15,11.07 v183.53,11.45
A3  (via drill 0.51)
  Top 0.254: U$24.A3 194.19,9.8 186.3,9.8 185.9,10.2 v185.9,10.64
  Bottom 0.254: IC2.37 67.36,11.39 68.75,11.39 69.37,10.77 71.15,10.77 71.75,10.18 71.75,7.23 74.62,4.35 81.88,4.35 87.78,10.25 185.52,10.25 v185.9,10.64
A4
  Bottom 0.254: IC2.36 63.71,12.5 64.22,12.5 65.23,11.49 66.11,11.49 67.02,10.58 68.41,10.58 69.03,9.96 70.81,9.96 70.94,9.84 70.94,6.89 74.28,3.54 82.22,3.54 88.12,9.44 192.44,9.44 192.8,9.8 U$24.A4
A5_SDS  (via drill 0.51)
  Top 0.254: v72.17,3.97 72.55,4.35 81.68,4.35 83.21,5.88 94.33,5.88 94.64,6.19 97.57,6.19 98.48,7.1 120.03,7.1 120.44,7.52 123.59,7.52 124.39,8.32 145.82,8.32 146.23,8.73 149.68,8.73 150.49,9.54 171.41,9.54 171.82,9.95 181.65,9.95 182.31,9.29 182.31,9.14 183.68,7.77 196.27,7.77 196.65,8.15 v197.7,8.15 198.54,8.99 209.06,8.99 209.57,9.5 210.7,9.5 211.6,8.6 JP1.1
  Bottom 0.254: IC2.35 60.68,6.92 61.9,5.7 70.98,5.7 72.17,4.51 v72.17,3.97 | JP2.7 197.7,8.03 v197.7,8.15
AIFO  (via drill 0.51)
  Top 0.254: IC100.1 23.07,16.57 23.19,16.69 23.19,18.97 28.49,24.27 v28.49,24.81
  Bottom 0.254: IC2.14 38.76,26.63 38.76,26.48 37.59,25.32 29.93,25.32 29.55,24.94 28.62,24.94 v28.49,24.81
AOFI  (via drill 0.51)
  Top 0.254: IC100.5 22.83,19.18 27.71,24.05 27.71,25.13 28.3,25.73 v29.23,25.73
  Bottom 0.254: v29.23,25.73 37.43,25.73 37.82,26.12 IC2.15
B-THERM  (via drill 0.51)
  Top 0.254: R10.P$1 210.81,19.7 195.07,19.7 193.77,18.39 191.43,18.39 190.53,19.29 178.13,19.29 176.02,17.18 176.02,12.8 174.8,11.57 171.15,11.57 170.74,11.17 149.82,11.17 149,10.36 145.45,10.36 145.05,9.95 123.72,9.95 122.92,9.14 119.77,9.14 119.35,8.73 97.81,8.73 96.9,7.81 93.96,7.81 93.66,7.51 82.53,7.51 81,5.98 58.53,5.98 v58.15,6.36
  Top 2: BEDTHERM.1 213.37,31.14 C9.1 213.37,24.54 R10.P$1
  Bottom 0.254: IC2.34 v58.15,6.36
E-DIR  (via drill 0.51)
  Top 0.254: P4.DIR 172.44,13.2 170.47,13.2 170.07,12.79 149.14,12.79 148.33,11.98 144.78,11.98 144.37,11.57 123.05,11.57 122.24,10.77 119.09,10.77 118.68,10.36 97.14,10.36 96.22,9.44 93.29,9.44 92.98,9.14 81.86,9.14 80.74,8.02 v80.2,8.02
  Bottom 0.254: v80.2,8.02 76.22,12 76.22,23.17 73.38,26.01 IC2.1
E-MS1
  Top 0.813: P4.MS1 158.35,17.27 JP18.1 159.77,19.05 161.08,19.05 162.15,20.12 162.71,20.12 R5.P$1
E-MS2
  Top 0.813: P4.MS2 163.25,16.71 JP19.1
E-MS3
  Top 0.813: P4.MS3 164.93,15.85 166.45,15.85 166.7,16.1 167,16.1 168.33,17.43 JP20.1
E-RESETSLEEP
  Top 0.813: P4.!RST P4.!SLP
E-STEP  (via drill 0.51)
  Top 0.254: P4.STEP 169.9,13.2 148.97,13.2 148.16,12.39 144.61,12.39 144.21,11.98 122.88,11.98 122.07,11.17 118.92,11.17 118.51,10.76 96.97,10.76 96.06,9.85 93.12,9.85 92.81,9.54 81.69,9.54 80.95,8.8 79.87,8.8 79.09,8.02 v78.97,8.02
  Bottom 0.254: v78.97,8.02 78.97,8.67 75.81,11.83 75.81,23 73.21,25.6 72.1,25.6 70.84,26.86 IC2.2
E-THERM  (via drill 0.51)
  Top 0.254: v54.55,6.77 55.34,7.55 61.15,7.55 61.56,7.96 62.54,7.96 63.31,7.2 80.5,7.2 82.03,8.73 93.15,8.73 93.46,9.03 96.39,9.03 97.31,9.95 118.85,9.95 119.26,10.36 122.41,10.36 123.22,11.17 144.54,11.17 144.95,11.57 148.5,11.57 149.31,12.39 170.24,12.39 170.64,12.79 174.29,12.79 174.8,13.3 174.8,17.69 177.3,20.19 177.3,21.5 179.2,23.4 R9.P$1
  Top 2: ENDTHERM.1 179.07,31.04 C10.1 179.07,24.84 R9.P$1
  Bottom 0.254: v54.55,6.77 55.75,7.97 55.75,12.84 IC2.33
FAN-GND
  pour Top (no thermals): 198.3,22.8 198.3,29.6 201.6,32.9 205.8,32.9 205.8,30.6 200.8,25.6 200.8,22.8
GND  (via drill 0.51, 5.2 pad 8)
  Top 0.254: IC100.7 20.07,20.48 v20,20.4 | IC100.25 15.78,18.52 v16.1,18.2 15.78,17.88 IC100.26 | IC100.21 15.57,21.12 15.8,20.9 v15.8,20.1 | IC100.18 11.81,23.07 C8.2
  Top 0.813: R6.P$2 189.54,22.47 Q1.3 | Q4.3 202.14,22.57 R1.P$2 | Q2.3 224.14,22.57 R11.P$2
  other vias: 233.3,1.7 230.2,9.7 229.2,13.3 228.1,13.3 225.8,25.3 225.8,24.1 203.8,25.2 203.8,24 191.2,25.1 191.2,23.9 25.9,17 194.3,1.5 64.9,2 68.4,20 58.4,19.3 41.8,19.7 24.8,24.6 13.6,28 19.5,5.3 5,10 5,20 5,30 245,30 245,20 245,10
  pour Top (isolate 0.305, rank 6): 0.1,40 249.9,40 249.9,-0.1 0.1,-0.1
  pour Bottom (isolate 0.305, rank 6): 0.1,40.1 249.9,40.1 249.9,0 0.1,0
HOTBED-GND
  pour Top (no thermals): 220.1,22.8 220.1,29.6 223.4,32.9 227.9,32.9 227.9,30.5 222.6,25.2 222.6,22.8
HOTEND-GND
  pour Top (no thermals): 185.5,22.8 185.5,29.6 188.8,32.9 193,32.9 193,30.2 188,25.2 188,22.8
N$1
  Top 2: P4.1B 168.51,31.83 U$27.1
N$3
  Top 2: P4.1A 165.97,31.15 U$27.2
N$4
  Top 2: P4.2A 163.43,29.47 162.7,30.2 162.7,30.9 161.39,32.21 U$27.3
N$5
  Top 2: P4.2B 160.89,28.71 160.68,28.93 160.22,28.93 158.89,30.26 158.89,30.6 157.22,32.27 U$27.4
N$6
  Top 2: P3.1B 142.31,31.41 142.71,31.81 U$26.1
N$7
  Top 2: P3.1A 139.77,31.15 U$26.2
N$8
  Top 2: P3.2A 137.23,29.47 136.5,30.2 136.5,30.67 U$26.3
N$9
  Top 2: P3.2B 134.12,27.62 134.12,28.83 132.69,30.26 132.69,31.1 131.52,32.27 U$26.4
N$10
  Top 2: P2.1B 116.11,31.83 U$25.1
N$11
  Top 2: P2.1A 113.57,31.15 U$25.2
N$12
  Top 2: P2.2A 111.03,29.47 110.3,30.2 110.3,30.67 U$25.3
N$13
  Top 2: P2.2B 108.49,28.25 106.49,30.26 106.49,31.1 105.32,32.27 U$25.4
N$14
  Top 2: P1.1B 90.31,27.45 U$17.1
N$15
  Top 2: P1.1A 87.37,31.15 U$17.2
N$16
  Top 2: P1.2A 84.83,29.47 84.1,30.2 84.1,30.67 U$17.3
N$17
  Top 2: P1.2B 81.72,27.62 81.72,28.83 80.29,30.26 80.29,31.1 79.29,32.1 78.66,32.1 U$17.4
N$23
  pour Top (rank 3, no thermals): 234.6,4.9 223.6,4.9 223.1,5.4 223.1,12.5 223.2,12.6 227.2,12.6 228.1,11.7 228.1,9.3 228.7,8.7 231.3,8.7 231.4,8.6 231.4,8 231.4,6.3 231.7,6 231.8,5.9 232.9,5.9 234.6,5.9
PB4-PWM-FAN  (via drill 0.51)
  Top 0.254: v62.05,6.77 62.43,6.39 80.84,6.39 82.37,7.92 93.49,7.92 93.79,8.22 96.73,8.22 97.64,9.14 119.18,9.14 119.6,9.55 122.75,9.55 123.55,10.36 144.88,10.36 145.28,10.76 148.84,10.76 149.65,11.57 170.57,11.57 170.98,11.98 174.63,11.98 175.61,12.96 175.61,17.35 177.96,19.7 190.7,19.7 191.6,18.8 193.6,18.8 194.33,19.53 | v62.1,16.6 63.22,17.72 IC2.5 | R1.P$1 195.79,20.99 194.6,19.8 194.33,19.53 | v193.2,19.53 194.33,19.53
  Top 0.813: Q4.1 197.06,22.57 R1.P$1
  Bottom 0.254: v62.05,6.77 61.75,7.07 61.75,16.25 v62.1,16.6 | U$24.PWM 192.02,13.48 190.69,14.81 190.69,17.89 191.61,18.81 191.78,18.81 192.5,19.53 v193.2,19.53
PB5-MOSI  (via drill 0.51)
  Top 0.254: v180.36,14.89 180.9,14.89 182.33,16.33 203.31,16.33 204.07,17.09 204.73,17.09 205.19,16.63 205.19,16.33 205.6,15.92 212.32,15.92 v212.71,16.31
  Bottom 0.254: IC2.6 60.68,26.32 61.61,25.39 69.06,25.39 69.46,24.99 70.99,24.99 71.59,24.38 72.71,24.38 74.59,22.5 74.59,8.41 75.8,7.2 80.7,7.2 86.6,13.1 178.02,13.1 179.82,14.89 v180.36,14.89 | v212.71,16.31 211.8,15.4 211.8,12.4 210.57,11.17 U$24.MOSI 209.81,10.18 209.81,9.93 209.07,9.19 207.09,9.19 206.3,8.4 206.3,4.9 205.04,3.64 JP2.4
PB6-MISO  (via drill 0.51)
  Top 0.254: v179.28,12.67 179.82,12.67 182.66,15.51 212.29,15.51 213.11,14.69 U$24.MISO
  Bottom 0.254: IC2.7 58.14,26.56 59.71,24.99 68.89,24.99 69.3,24.58 70.82,24.58 71.43,23.97 72.54,23.97 74.19,22.33 74.19,17.29 72.1,15.2 72.1,12.7 73.78,11.02 73.78,8.07 75.46,6.39 81.04,6.39 86.94,12.29 178.9,12.29 v179.28,12.67 | JP2.1 206.71,6.64 206.71,8.23 207.26,8.79 209.24,8.79 210.15,9.7 211,9.7 211.9,10.6 211.9,11.7 213.11,12.91 U$24.MISO
PB7-SCK  (via drill 0.51)
  Top 0.254: U$24.SCK 209.4,12.31 209.4,9.9 208.89,9.39 204.2,9.39 | v181.86,11.86 182.04,11.86 182.34,11.56 182.34,10.95 182.72,10.57 182.72,9.31 183.85,8.17 196.1,8.17 197.32,9.39 204.2,9.39 | 204.2,9.39 204.2,9.7 v204.4,9.9 | v203.6,8.2 205.04,6.76 JP2.3
  Bottom 0.254: IC2.8 55.6,27.4 58.42,24.58 68.72,24.58 69.13,24.17 70.65,24.17 71.26,23.57 72.37,23.57 73.78,22.16 73.78,17.46 72.22,15.9 70.7,15.9 69.6,14.8 69.6,12.8 70.41,11.99 71.66,11.99 72.97,10.68 72.97,7.73 75.13,5.57 81.37,5.57 87.27,11.47 180.88,11.47 181.26,11.86 v181.86,11.86 | v204.4,9.9 204.4,9 v203.6,8.2
PC0-SCL  (via drill 0.51)
  Top 0.254: v28.4,9.8 29.8,9.8 30.99,8.61 33.47,8.61 33.88,8.2 35.55,8.2 36.08,7.66 36.76,7.66 39.45,4.97 41.52,4.97 43.13,3.36 46.17,3.36 46.95,4.14 53,4.14 53.62,4.76 81.51,4.76 83.04,6.29 94.16,6.29 94.47,6.6 97.4,6.6 98.32,7.51 119.86,7.51 120.27,7.92 123.42,7.92 124.23,8.73 145.55,8.73 145.96,9.14 149.51,9.14 150.32,9.95 171.25,9.95 171.65,10.36 178.66,10.36 183,14.7 198.5,14.7 199.2,14 199.2,12.7 199.7,12.2 201.67,12.2 U$24.SCL
  Bottom 0.254: IC2.22 28.4,12.25 v28.4,9.8 | U$24.SCL 201.7,12.23 201.7,10.5 200.3,9.1 197.2,9.1 196.7,8.6 196.7,7.5 197.2,7 198,7 198.7,6.3 198.7,4.51 JP2.10
PC1-SDA  (via drill 0.51)
  Top 0.254: v30.91,9.8 31.45,9.8 32.24,9.01 33.64,9.01 34.05,8.61 35.72,8.61 36.25,8.07 36.93,8.07 39.62,5.38 41.69,5.38 43.3,3.77 46,3.77 46.78,4.55 52.83,4.55 53.45,5.17 81.34,5.17 82.87,6.7 93.99,6.7 94.3,7 97.23,7 98.15,7.92 119.69,7.92 120.1,8.33 123.25,8.33 124.06,9.14 145.38,9.14 145.79,9.54 149.34,9.54 150.15,10.36 171.08,10.36 171.49,10.76 178.49,10.76 182.83,15.11 198.67,15.11 199.61,14.17 199.61,13.89 200.02,13.48 U$24.SDA
  Bottom 0.254: IC2.23 30.2,10.51 v30.91,9.8 | U$24.SDA 199.2,12.27 199.2,10.2 198.51,9.51 197.03,9.51 196.29,8.77 196.29,6.9 JP2.9
PD2-RX1  (via drill 0.51)
  Top 0.254: IC2.16 35.28,25.72 35.6,25.4 v48.8,25.4 | U$24.RX1 196.5,12.11 196.5,10.3 195.59,9.39 185.21,9.39 184.7,9.9 v184.7,11.04
  Bottom 0.254: v48.8,25.4 57,25.4 58.23,24.17 68.55,24.17 68.96,23.77 70.48,23.77 71.09,23.16 72.2,23.16 73.38,21.99 73.38,17.62 72.06,16.31 70.53,16.31 69.83,15.6 67.9,15.6 67,14.7 67,12.8 68,11.8 68.92,11.8 69.53,11.18 71.32,11.18 72.16,10.35 72.16,7.4 74.79,4.76 81.71,4.76 87.61,10.66 184.32,10.66 v184.7,11.04
PD3-TX1  (via drill 0.51)
  Top 0.254: IC2.17 32.74,26.36 34.11,24.99 48.04,24.99 v48.8,24.23
  Bottom 0.254: v48.8,24.23 49.56,24.99 56.83,24.99 58.06,23.77 68.38,23.77 68.79,23.36 70.31,23.36 70.92,22.75 72.03,22.75 72.97,21.82 72.97,17.79 71.89,16.71 70.36,16.71 69.66,16.01 67.73,16.01 67.22,15.5 65.1,15.5 64.4,14.8 64.4,12.9 65.4,11.9 66.28,11.9 67.19,10.99 68.58,10.99 69.2,10.37 70.98,10.37 71.34,10.01 71.34,7.06 74.45,3.95 82.05,3.95 87.95,9.85 191.35,9.85 191.7,10.2 191.7,11.7 192.2,12.2 194.05,12.2 U$24.TX1
USBDM
  Top 0.254: J1.D- 18.31,27.88 18.31,26.13 16.55,24.38 IC100.16
USBDP
  Top 0.254: IC100.15 16.62,25.02 17.9,26.3 17.9,29.45 J1.D+
X-DIR  (via drill 0.51)
  Top 0.254: P1.DIR 93.84,13.2 91.88,13.2 91.47,12.79 80.35,12.79 79.61,12.06 78.53,12.06 78.13,11.66 76.86,11.66 76.44,11.24 75.22,11.24 73.61,9.64 64.32,9.64 63.55,10.4 60.51,10.4 60.1,9.99 53.67,9.99 51.5,7.82 40.63,7.82 39.04,9.4 v39.04,9.94
  Bottom 0.254: v39.04,9.94 39.04,11.67 IC2.27
X-MS1
  Top 0.813: P1.MS1 79.61,14.49 JP9.1 81.26,19.1 82.57,19.1 83.58,20.12 85.8,20.12 85.92,19.99 R2.P$1
X-MS2
  Top 0.813: P1.MS2 82.29,14.89 84.69,17.29 JP10.1
X-MS3
  Top 0.813: P1.MS3 86.33,15.85 87.89,15.85 89.49,17.45 JP11.1
X-RESETSLEEP
  Top 0.813: P1.!RST P1.!SLP
X-STEP
  Top 0.254: P1.STEP 91.3,13.2 80.18,13.2 79.44,12.46 78.36,12.46 77.96,12.06 76.69,12.06 76.28,11.65 75.05,11.65 73.44,10.04 64.48,10.04 63.72,10.81 60.34,10.81 59.93,10.4 53.51,10.4 51.33,8.23 40.8,8.23 39.83,9.19 39.83,10.47 38.9,11.4 26.2,11.4 25.12,12.48 IC2.21
X-STOP  (via drill 0.51)
  Top 0.254: XLIM.1 97.9,30.59 97.9,15.71 94.88,12.69 91.94,12.69 91.64,12.39 80.52,12.39 79.78,11.65 78.69,11.65 78.3,11.25 77.03,11.25 76.61,10.84 75.39,10.84 73.78,9.23 64.15,9.23 63.39,9.99 60.67,9.99 60.27,9.59 53.84,9.59 51.67,7.41 40.46,7.41 38.16,9.72 38.16,10.34 37.5,10.99 33.28,10.99 v32.9,10.61
  Bottom 0.254: v32.9,10.61 32.9,12.83 IC2.24
XTAL1
  Top 0.813: IC2.13 42.9,33.49 Q3.2 41.05,35.34 C6.2
XTAL2
  Top 0.813: IC2.12 45.44,32.43 Q3.1 48.35,35.34 C5.2
Y-DIR  (via drill 0.51)
  Top 0.254: P2.DIR 120.14,13.3 118.17,13.3 117.67,12.79 96.13,12.79 95.21,11.88 92.28,11.88 91.97,11.57 80.85,11.57 80.11,10.84 79.03,10.84 78.63,10.44 77.36,10.44 76.95,10.02 75.72,10.02 74.12,8.42 63.81,8.42 63.05,9.18 61.05,9.18 60.64,8.77 54.18,8.77 51.99,6.58 45.4,6.58 v45,6.18
  Bottom 0.254: v45,6.18 45,7.8 46.1,8.9 46.1,12.33 IC2.29
Y-MS1
  Top 0.813: P2.MS1 105.95,17.27 JP12.1
  Bottom 0.813: JP12.1 106.13,17.53 107.9,19.3 113.06,19.3 R3.P$1
Y-MS2
  Top 0.813: P2.MS2 111.21,17.07 JP13.1
Y-MS3
  Top 0.813: P2.MS3 112.53,15.85 114.41,15.85 116.01,17.45 JP14.1
Y-RESETSLEEP
  Top 0.813: P2.!RST P2.!SLP
Y-STEP  (via drill 0.51)
  Top 0.254: P2.STEP 117.5,13.2 95.96,13.2 95.05,12.29 92.11,12.29 91.81,11.98 80.68,11.98 79.94,11.24 78.86,11.24 78.46,10.84 77.19,10.84 76.78,10.43 75.55,10.43 73.95,8.82 63.98,8.82 63.22,9.59 60.88,9.59 60.48,9.18 54.01,9.18 51.83,7 44.32,7 v43.9,6.58
  Bottom 0.254: v43.9,6.58 43.9,7.27 45.69,9.07 45.69,11.11 43.81,12.99 IC2.28
Y-STOP  (via drill 0.51)
  Top 0.254: YLIM.1 122.7,29.19 122.7,14.1 121.4,12.8 118.25,12.8 117.84,12.39 96.3,12.39 95.38,11.47 92.45,11.47 92.14,11.17 81.02,11.17 80.28,10.43 79.2,10.43 78.8,10.03 77.53,10.03 77.12,9.62 75.89,9.62 74.29,8.01 63.64,8.01 62.88,8.77 61.22,8.77 60.81,8.37 54.35,8.37 52.15,6.17 46.11,6.17 45.33,5.39 43.97,5.39 42.36,7.01 40.29,7.01 37.7,9.6 37.7,10.22 37.46,10.46 35.1,10.46 v34.85,10.21
  Bottom 0.254: v34.85,10.21 34.85,12.56 IC2.25
Z-DIR  (via drill 0.51)
  Top 0.254: P3.DIR 146.24,13.2 144.28,13.2 143.87,12.79 122.54,12.79 121.74,11.99 118.59,11.99 118.17,11.57 96.63,11.57 95.72,10.66 92.78,10.66 92.48,10.36 81.36,10.36 80.62,9.62 79.54,9.62 79.14,9.22 77.87,9.22 v77.08,8.42
  Bottom 0.254: v77.08,8.42 77.08,9.99 75.41,11.66 75.41,22.83 73.05,25.19 71.93,25.19 71.33,25.8 69.8,25.8 68.3,27.3 IC2.3
Z-MS1
  Top 0.813: P3.MS1 131.65,14.85 JP15.1 133.25,19.05 134.56,19.05 135.62,20.12 137.84,20.12 138.18,19.78 139.06,19.78 R4.P$1
Z-MS2
  Top 0.813: P3.MS2 136.73,16.39 JP16.1
Z-MS3
  Top 0.813: P3.MS3 138.73,15.85 139.93,15.85 141.53,17.45 JP17.1
Z-RESETSLEEP
  Top 0.813: P3.!RST P3.!SLP
Z-STEP  (via drill 0.51)
  Top 0.254: P3.STEP 143.7,13.2 122.38,13.2 121.57,12.39 118.42,12.39 118,11.98 96.46,11.98 95.55,11.07 92.61,11.07 92.31,10.76 81.19,10.76 80.45,10.02 79.37,10.02 78.97,9.62 77.7,9.62 77.29,9.21 76.6,9.21 v75.81,8.42
  Bottom 0.254: v75.81,8.42 75.81,10.68 75,11.49 75,22.66 72.88,24.79 71.76,24.79 71.16,25.39 69.63,25.39 69.22,25.8 66.8,25.8 65.76,26.84 IC2.4
Z-STOP  (via drill 0.51)
  Top 0.254: ZLIM.1 149,29.29 149,13.8 147.99,12.79 144.44,12.79 144.04,12.39 122.71,12.39 121.91,11.58 118.75,11.58 118.34,11.17 96.8,11.17 95.89,10.25 92.95,10.25 92.65,9.95 81.53,9.95 80.79,9.21 79.71,9.21 79.31,8.81 78.64,8.81 77.44,7.61 63.48,7.61 62.71,8.37 61.39,8.37 60.98,7.96 54.52,7.96 52.32,5.77 46.27,5.77 45.49,4.99 43.81,4.99 42.19,6.6 40.12,6.6 37.29,9.43 37.29,9.51 37.13,9.67 v36.91,9.67
  Bottom 0.254: IC2.26 37.97,12.84 37.97,10.73 v36.91,9.67

### Text on the board
tPlace: RESET | USB | 0.1uF | 0.1uF | auto | 47UF | 16/20mhz | rst | 22p | 22p | X-MOTOR | Y-MOTOR | YEND | Z-MOTOR | ZEND | E-MOTOR | XEND | PWR-IN | 0.1uF | FT232 | 100UF | HENDTH | 100k | BEDTH | 100k | 100UF | 100UF | 100UF | HOTEND | FAN | HOTBED | 0.1uF | 12V | 5V | FAN | TX1 | RX1 | SDA | SCL | RST | SCK | MISO | 0.1uF | 0.1uF | GND | GND | A4 | A3 | A2 | A1 | A0 | GND | MOSI | 5V | SDA | A5SD | RST | SCK | MISO | A5 | SD+LCD | SCL | NC | GND | MOSI | 5V
bPlace: PWR-IN | USB | X-MOTOR | XEND | Y-MOTOR | YEND | Z-MOTOR | ZEND | E-MOTOR | HENDTH | HOTEND | FAN | BEDTH | HOTBED | + | + | + | + | + | + | +